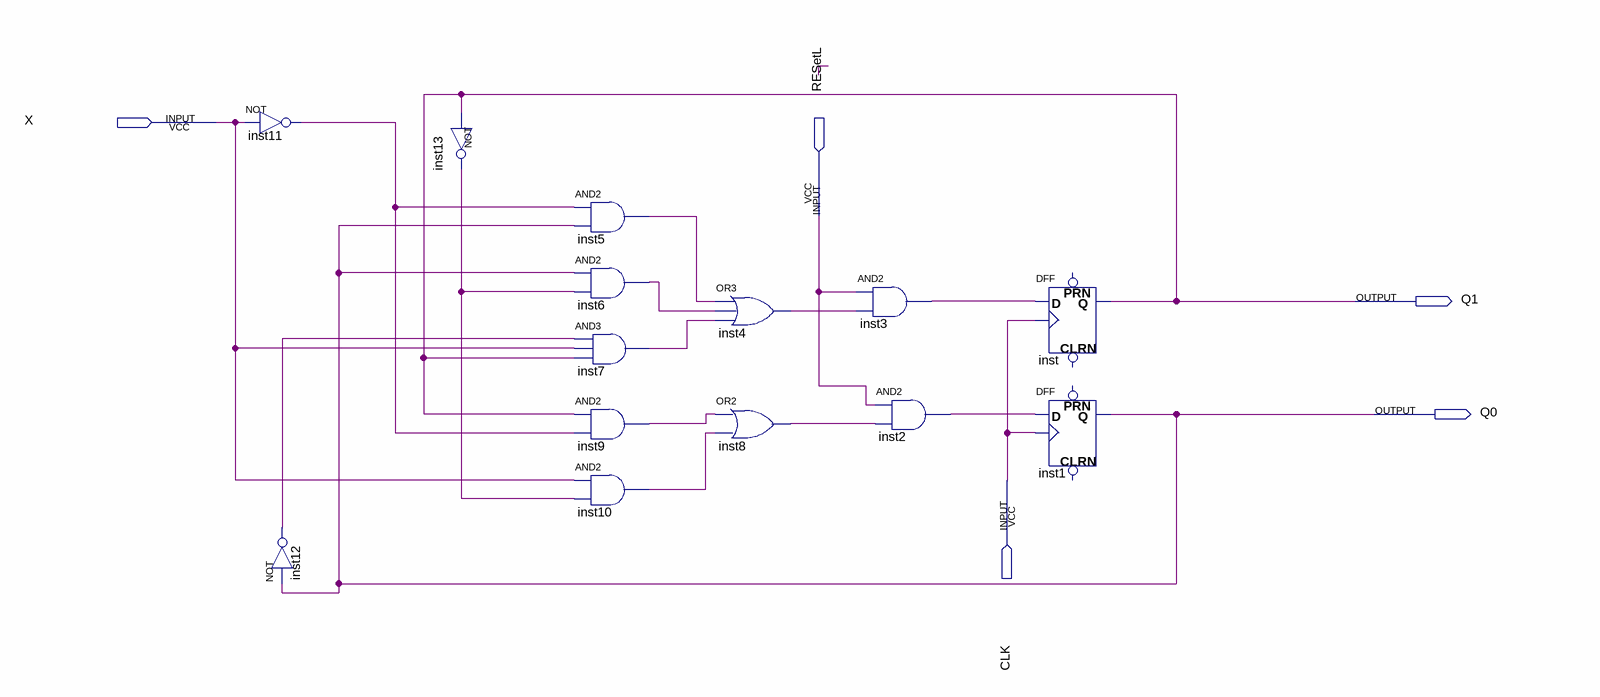
[diagram p0: schematic sheet]
// Quartus schematic MEF.bdf as structural Verilog: 14 symbols, 5 pins
module MEF (
  input  X,
  input  RESetL,
  input  CLK,
  output Q1,
  output Q0
);

  wire inst2_out, inst3_out, inst4_out, inst5_out, inst6_out, inst7_out, inst8_out, inst9_out, inst10_out,
       inst11_out, inst12_out, inst13_out;

  not inst11 (inst11_out, X);
  not inst12 (inst12_out, Q0);
  not inst13 (inst13_out, Q1);
  and inst5 (inst5_out, inst11_out, Q0);
  and inst6 (inst6_out, Q0, inst13_out);
  and inst7 (inst7_out, inst12_out, X, Q1);
  and inst9 (inst9_out, Q1, inst11_out);
  and inst10 (inst10_out, X, inst13_out);
  or inst4 (inst4_out, inst5_out, inst6_out, inst7_out);
  or inst8 (inst8_out, inst9_out, inst10_out);
  and inst3 (inst3_out, RESetL, inst4_out);
  and inst2 (inst2_out, RESetL, inst8_out);
  DFF inst (.CLK(CLK), .D(inst3_out), .Q(Q1));  // open: CLRN, PRN
  DFF inst1 (.CLK(CLK), .D(inst2_out), .Q(Q0));  // open: CLRN, PRN
endmodule
